# Altium schematic sheet MCU089A_AltRouting_Misc.SchDoc
size 431 x 279 mm; Date: Not shown in title block; ApprovedBy: Not shown in title block; CheckedBy: Not shown in title block; Author: Not shown in title block; CompanyName: Not shown in title block; Engineer: Not shown in title block; Organization: Not shown in title block; Address1: Not shown in title block; Address2: Not shown in title block; Address3: Not shown in title block; Address4: Not shown in title block; DocumentNumber: 3; Revision: Use project parameter SCH_Rev; SheetNumber: 3; SheetTotal: 8; PageSetup: Record=PageOptions|CenterHorizontal=True|CenterVertical=True|PrintScale=1.00|XCorrection=1.00|YCorrection=1.00|PrintKind=0|BorderSize=5000000|LeftOffset=0|BottomOffset=0|Orientation=2|PaperLength=1000|PaperWidth=1000|Scale=100|PaperSource=15|PrintQuality=600|MediaType=1|DitherType=10|PaperKind=Letter|PrintScaleMode=1; CurrentTime: Not shown in title block; CurrentDate: Not shown in title block; Time: Not shown in title block; DocumentFullPathAndName: Not shown in title block; DocumentName: Not shown in title block; ModifiedDate: Not shown in title block; ImagePath: Not shown in title block
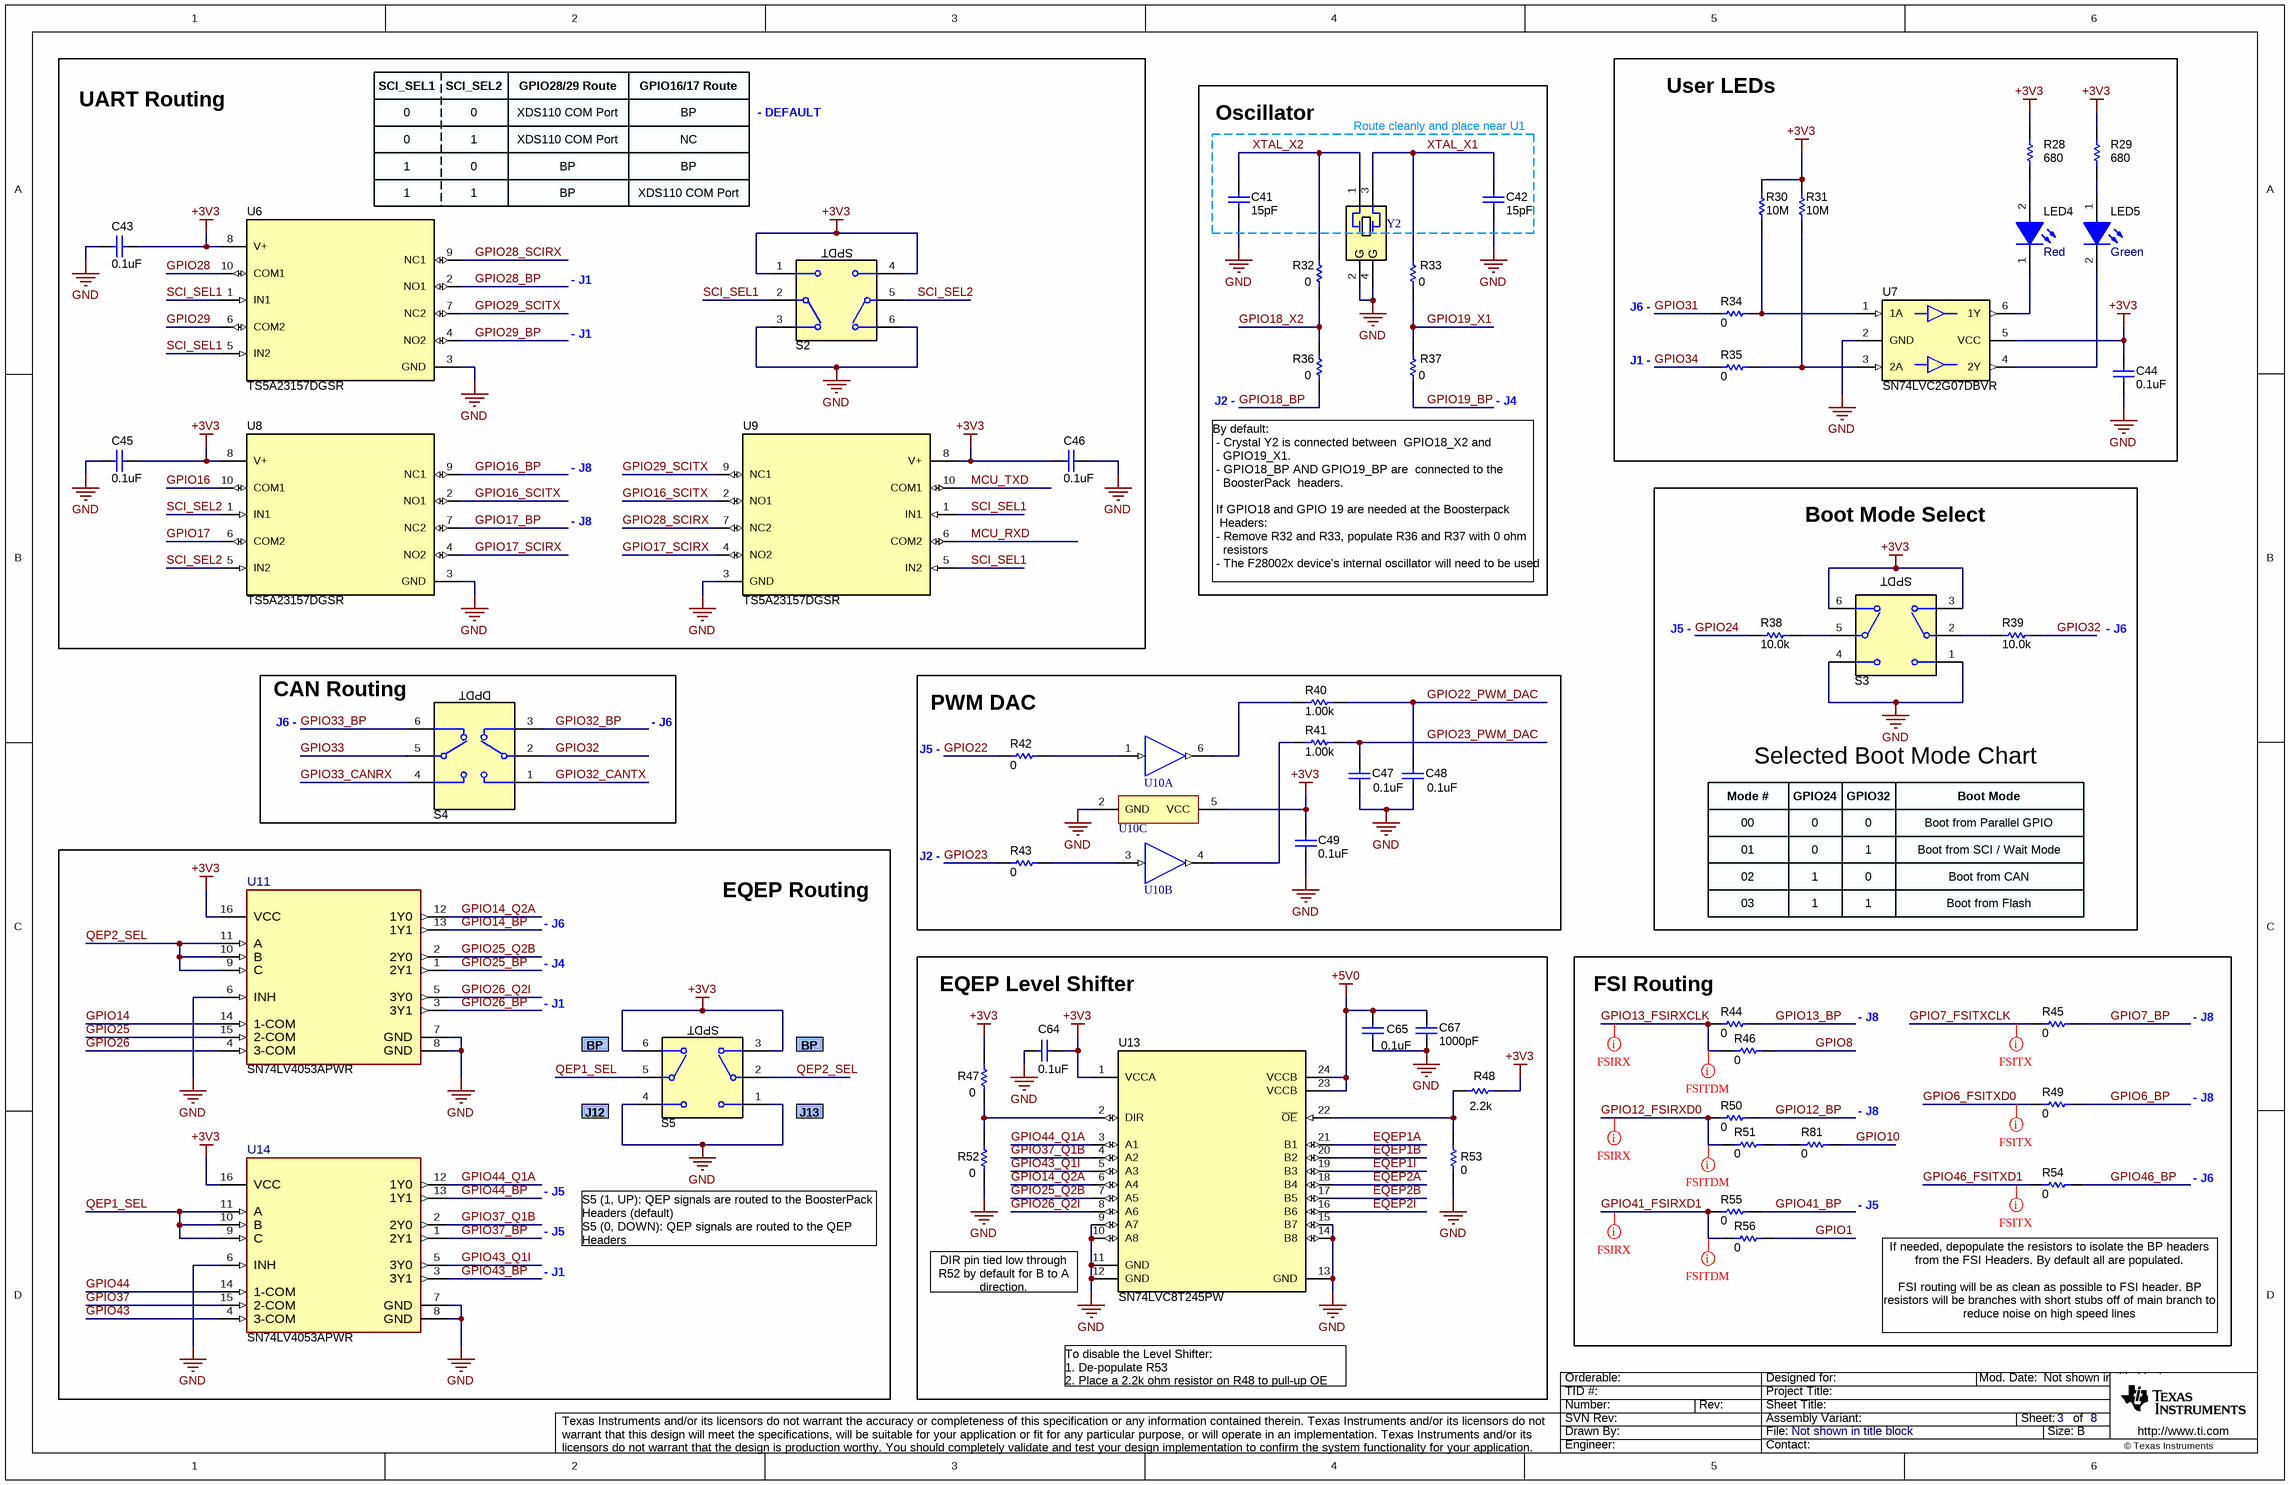
[diagram p0: MCU089A_AltRouting_Misc.SchDoc]

## Parts
C41  ValueDisplayed: 15pF  [0402]  (hidden comment: 885012005056)
C42  ValueDisplayed: 15pF  [0402]  (hidden comment: 885012005056)
C43  ValueDisplayed: 0.1uF  [0402]  (hidden comment: GRM155R71A104KA01D)
C44  ValueDisplayed: 0.1uF  [0402]  (hidden comment: GRM155R71A104KA01D)
C45  ValueDisplayed: 0.1uF  [0402]  (hidden comment: GRM155R71A104KA01D)
C46  ValueDisplayed: 0.1uF  [0402]  (hidden comment: GRM155R71A104KA01D)
C47  ValueDisplayed: 0.1uF  [0402]  (hidden comment: TMK105B7104MV-FR)
C48  ValueDisplayed: 0.1uF  [0402]  (hidden comment: TMK105B7104MV-FR)
C49  ValueDisplayed: 0.1uF  [0402]  (hidden comment: GRM155R71A104KA01D)
C64  ValueDisplayed: 0.1uF  [0402]  (hidden comment: GRM155R71A104KA01D)
C65  ValueDisplayed: 0.1uF  [0402]  (hidden comment: GRM155R71A104KA01D)
C67  ValueDisplayed: 1000pF  [0402]  (hidden comment: 885012205061)
LED4  value Red  [WL-SMCW_RED_0805]  (hidden comment: 150080SS75000)
LED5  value Green  [LED_LTST-C171]  (hidden comment: LTST-C171GKT)
R28  ValueDisplayed: 680  [0402]  (hidden comment: CRCW0402680RJNED)
R29  ValueDisplayed: 680  [0402]  (hidden comment: CRCW0402680RJNED)
R30  ValueDisplayed: 10M  [0402]  (hidden comment: CRCW040210M0JNED)
R31  ValueDisplayed: 10M  [0402]  (hidden comment: CRCW040210M0JNED)
R32  ValueDisplayed: 0  [0603]  (hidden comment: CRCW06030000Z0EA)
R33  ValueDisplayed: 0  [0603]  (hidden comment: CRCW06030000Z0EA)
R34  ValueDisplayed: 0  [0603]  (hidden comment: CRCW06030000Z0EA)
R35  ValueDisplayed: 0  [0603]  (hidden comment: CRCW06030000Z0EA)
R36  ValueDisplayed: 0  [0603]  (hidden comment: CRCW06030000Z0EA)
R37  ValueDisplayed: 0  [0603]  (hidden comment: CRCW06030000Z0EA)
R38  ValueDisplayed: 10.0k  [0603]  (hidden comment: RC0603FR-0710KL)
R39  ValueDisplayed: 10.0k  [0603]  (hidden comment: RC0603FR-0710KL)
R40  ValueDisplayed: 1.00k  [0402]  (hidden comment: CRCW04021K00FKED)
R41  ValueDisplayed: 1.00k  [0402]  (hidden comment: CRCW04021K00FKED)
R42  ValueDisplayed: 0  [0603]  (hidden comment: CRCW06030000Z0EA)
R43  ValueDisplayed: 0  [0603]  (hidden comment: CRCW06030000Z0EA)
R44  ValueDisplayed: 0  [0603]  (hidden comment: CRCW06030000Z0EA)
R45  ValueDisplayed: 0  [0603]  (hidden comment: CRCW06030000Z0EA)
R46  ValueDisplayed: 0  [0603]  (hidden comment: CRCW06030000Z0EA)
R47  ValueDisplayed: 0  [0603]  (hidden comment: CRCW06030000Z0EA)
R48  ValueDisplayed: 2.2k  [0603]  (hidden comment: CRCW06032K20JNEA)
R49  ValueDisplayed: 0  [0603]  (hidden comment: CRCW06030000Z0EA)
R50  ValueDisplayed: 0  [0603]  (hidden comment: CRCW06030000Z0EA)
R51  ValueDisplayed: 0  [0603]  (hidden comment: CRCW06030000Z0EA)
R52  ValueDisplayed: 0  [0603]  (hidden comment: CRCW06030000Z0EA)
R53  ValueDisplayed: 0  [0603]  (hidden comment: CRCW06030000Z0EA)
R54  ValueDisplayed: 0  [0603]  (hidden comment: CRCW06030000Z0EA)
R55  ValueDisplayed: 0  [0603]  (hidden comment: CRCW06030000Z0EA)
R56  ValueDisplayed: 0  [0603]  (hidden comment: CRCW06030000Z0EA)
R81  ValueDisplayed: 0  [0603]  (hidden comment: CRCW06030000Z0EA)
S2  CAS-D20TA  [SW_CAS-D20TA]  (value not drawn)
S3  CAS-D20TA  [SW_CAS-D20TA]  (value not drawn)
S4  CAS-220TA  [SW_CAS-220TA]  (value not drawn)
S5  CAS-D20TA  [SW_CAS-D20TA]  (value not drawn)
U6  TS5A23157DGSR  [DGS0010A_N]
U7  SN74LVC2G07DBVR  [DBV0006A_N]
U8  TS5A23157DGSR  [DGS0010A_N]
U9  TS5A23157DGSR  [DGS0010A_N]
U10  SN74LVC2G34DBVR  [DBV0006A_N]  (value not drawn)  (parts A,B,C of 3)
U11  SN74LV4053APWR  [PW0016A-MFG]
U13  SN74LVC8T245PW  [PW0024A_N]
U14  SN74LV4053APWR  [PW0016A-MFG]
Y2  ECS-200-18-30B-AGN-TR  [ECS_ECX-53B]  (value not drawn)

## Blocks framed on the sheet
UART Routing: C43 C45 C46 S2 U6 U8 U9
Oscillator: C41 C42 R32 R33 R36 R37 Y2
User LEDs: C44 LED4 LED5 R28-R31 R34 R35 U7
Selected Boot Mode Chart: R38 R39 S3
CAN Routing: S4
PWM DAC: C47-C49 R40-R43 U10
EQEP Routing: S5 U11 U14
EQEP Level Shifter: C64 C65 C67 R47 R48 R52 R53 U13
FSI Routing: R44-R46 R49-R51 R54-R56 R81

## Nets
+3V3: C43.1 C44.2 C45.1 C46.2 C49.2 C64.1 R28.2 R29.2 R30.2 R31.2 R47.2 R48.2 S2.1 S2.4 S3.3 S3.6 S5.3 S5.6 U6.8(V+) U7.5(VCC) U8.8(V+) U9.8(V+) U10.5(VCC) U11.16(VCC) U13.1(VCCA) U14.16(VCC)
+5V0: C65.2 C67.1 U13.23(VCCB) U13.24(VCCB)
GND: C41.2 C42.2 C43.2 C44.1 C45.2 C46.1 C47.2 C48.2 C49.1 C64.2 C65.1 C67.2 R52.1 R53.2 S2.3 S2.6 S3.1 S3.4 S5.1 S5.4 U6.3(GND) U7.2(GND) U8.3(GND) U9.3(GND) U10.2(GND) U11.6(INH) U11.7(GND) U11.8(GND) U13.9(A7) U13.10(A8) U13.11(GND) U13.12(GND) U13.13(GND) U13.14(B8) U13.15(B7) U14.6(INH) U14.7(GND) U14.8(GND) Y2.2(GND) Y2.4(GND)
EQEP1A: U13.21(B1)
EQEP1B: U13.20(B2)
EQEP1I: U13.19(B3)
EQEP2A: U13.18(B4)
EQEP2B: U13.17(B5)
EQEP2I: U13.16(B6)
GPIO1: R56.2
GPIO6_BP: R49.2
GPIO6_FSITXD0: R49.1
GPIO7_BP: R45.2
GPIO7_FSITXCLK: R45.1
GPIO8: R46.2
GPIO10: R81.2
GPIO12_BP: R50.2
GPIO12_FSIRXD0: R50.1 R51.1
GPIO13_BP: R44.2
GPIO13_FSIRXCLK: R44.1 R46.1
GPIO14: U11.14(1-COM)
GPIO14_BP: U11.13(1Y1)
GPIO14_Q2A: U11.12(1Y0) U13.6(A4)
GPIO16: U8.10(COM1)
GPIO16_BP: U8.9(NC1)
GPIO16_SCITX: U8.2(NO1) U9.2(NO1)
GPIO17: U8.6(COM2)
GPIO17_BP: U8.7(NC2)
GPIO17_SCIRX: U8.4(NO2) U9.4(NO2)
GPIO18_BP: R36.1
GPIO18_X2: R32.1 R36.2
GPIO19_BP: R37.1
GPIO19_X1: R33.1 R37.2
GPIO22: R42.1
GPIO22_PWM_DAC: C48.1 R40.2
GPIO23: R43.1
GPIO23_PWM_DAC: C47.1 R41.2
GPIO24: R38.1
GPIO25: U11.15(2-COM)
GPIO25_BP: U11.1(2Y1)
GPIO25_Q2B: U11.2(2Y0) U13.7(A5)
GPIO26: U11.4(3-COM)
GPIO26_BP: U11.3(3Y1)
GPIO26_Q2I: U11.5(3Y0) U13.8(A6)
GPIO28: U6.10(COM1)
GPIO28_BP: U6.2(NO1)
GPIO28_SCIRX: U6.9(NC1) U9.7(NC2)
GPIO29: U6.6(COM2)
GPIO29_BP: U6.4(NO2)
GPIO29_SCITX: U6.7(NC2) U9.9(NC1)
GPIO31: R34.1
GPIO32: R39.2 S4.2
GPIO32_BP: S4.3
GPIO32_CANTX: S4.1
GPIO33: S4.5
GPIO33_BP: S4.6
GPIO33_CANRX: S4.4
GPIO34: R35.1
GPIO37: U14.15(2-COM)
GPIO37_BP: U14.1(2Y1)
GPIO37_Q1B: U13.4(A2) U14.2(2Y0)
GPIO41_BP: R55.2
GPIO41_FSIRXD1: R55.1 R56.1
GPIO43: U14.4(3-COM)
GPIO43_BP: U14.3(3Y1)
GPIO43_Q1I: U13.5(A3) U14.5(3Y0)
GPIO44: U14.14(1-COM)
GPIO44_BP: U14.13(1Y1)
GPIO44_Q1A: U13.3(A1) U14.12(1Y0)
GPIO46_BP: R54.2
GPIO46_FSITXD1: R54.1
MCU_RXD: U9.6(COM2)
MCU_TXD: U9.10(COM1)
QEP1_SEL: S5.5(C) U14.9(C) U14.10(B) U14.11(A)
QEP2_SEL: S5.2(C) U11.9(C) U11.10(B) U11.11(A)
SCI_SEL1: S2.2(C) U6.1(IN1) U6.5(IN2) U9.1(IN1) U9.5(IN2)
SCI_SEL2: S2.5(C) U8.1(IN1) U8.5(IN2)
XTAL_X1: C42.1 R33.2 Y2.3
XTAL_X2: C41.1 R32.2 Y2.1
NetLED4_1: LED4.1(K) U7.6(1Y)
NetLED4_2: LED4.2(A) R28.1
NetLED5_1: LED5.1(A) R29.1
NetLED5_2: LED5.2(K) U7.4(2Y)
NetR30_1: R30.1 R34.2 U7.1(1A)
NetR31_1: R31.1 R35.2 U7.3(2A)
NetR38_2: R38.2 S3.5(C)
NetR39_1: R39.1 S3.2(C)
NetR40_1: R40.1 U10.6(1Y)
NetR41_1: R41.1 U10.4(2Y)
NetR42_2: R42.2 U10.1(1A)
NetR43_2: R43.2 U10.3(2A)
NetR47_1: R47.1 R52.2 U13.2(DIR)
NetR48_1: R48.1 R53.1 U13.22(~{OE})
NetR51_2: R51.2 R81.1

## Layout directives
net class FSIRX: GPIO12_FSIRXD0, GPIO13_FSIRXCLK, GPIO41_FSIRXD1
net class FSITX: GPIO6_FSITXD0, GPIO7_FSITXCLK, GPIO46_FSITXD1

## Notes on the sheet
- SCI_SEL1
- SCI_SEL2
- GPIO28/29 Route
- GPIO16/17 Route
- 0
- 1
- XDS110 COM Port
- BP
- NC
- - DEFAULT
- Route cleanly and place near U1
- (near U6) 1
- - J1
- (near S2) SPDT
- J6 -
- J1 -
- J2 -
- - J4
- - J8
- Boot Mode Select
- By default:
  - Crystal Y2 is connected between  GPIO18_X2 and
  GPIO19_X1.
  - GPIO18_BP AND GPIO19_BP are  connected to the
  BoosterPack  headers.
  If GPIO18 and GPIO 19 are needed at the Boosterpack
  Headers:
  - Remove R32 and R33, populate R36 and R37 with 0 ohm
  resistors
  - The F28002x device's internal oscillator will need to be used
- J5 -
- (near S3) SPDT
- - J6
- (near S4) DPDT
- Mode #
- 00
- GPIO24
- GPIO32
- Boot Mode
- Boot from Parallel GPIO
- 01
- 02
- 03
- Boot from SCI / Wait Mode
- Boot from CAN
- Boot from Flash
- (near S5) SPDT
- (near R81) - J8
- J12
- J13
- - J5
- S5 (1, UP): QEP signals are routed to the BoosterPack Headers (default)
  S5 (0, DOWN): QEP signals are routed to the QEP Headers
- (near U13) DIR pin tied low through R52 by default for B to A direction.
- If needed, depopulate the resistors to isolate the BP headers from the FSI Headers. By default all are populated.
  FSI routing will be as clean as possible to FSI header. BP resistors will be branches with short stubs off of main branch to reduce noise on high speed lines
- To disable the Level Shifter:
  1. De-populate R53
  2. Place a 2.2k ohm resistor on R48 to pull-up OE
- Drawn By:
- SVN Rev:
- Number:
- TID #:
- Orderable:
- Rev:
- Sheet Title:
- File:
- Project Title:
- Designed for:
- Assembly Variant:
- Mod. Date:
- Sheet:
- Size:
- of
- B
- http://www.ti.com
- Texas Instruments and/or its licensors do not warrant the accuracy or completeness of this specification or any information contained therein. Texas Instruments and/or its licensors do not warrant that this design will meet the specifications, will be suitable for your application or fit for any particular purpose, or will operate in an implementation. Texas Instruments and/or its licensors do not warrant that the design is production worthy. You should completely validate and test your design implementation to confirm the system functionality for your application.
- Engineer:
- Contact:
- © Texas Instruments
- (in symbol CMP-0080365-2) G

## Library data of the parts
C41 C42 = CMP-0006216-2: CAP, CERM, 15 pF, 50 V, +/- 5%, C0G/NP0, 0402; Manufacturer: Wurth Elektronik; Polarized: N; Value: 15pF; U/M: EA; Value1: Unknown; VDC_V: 50V; TaMin_C: -55°C; TaMax_C: 125°C; SizeArea_mm2: 0.5; SizeAreaWB_mm2: 3; SizeX_mm: 1; SizeZ_mm: 0.6; AEC Category: Q200; CompType: Capacitor; PartNumber: 885012005056; PackageReference: 0402; RoHS: Y; Cap_F: 15pF; Tolerance_%: 5%; Value2: 50V; MountType: SMT; Technology: Ceramic; TempCo: C0G/NP0; Cap_Case: 0402; SizeY_mm: 0.5; Published: 2008-06-19; Publisher: Texas Instruments; LatestRevisionDate: 2017-03-09; ComponentLink1Description: Datasheet link; ComponentLink1URL: http://katalog.we-online.de/pbs/datasheet/885012005056.pdf; Supplier 1: Mouser; Supplier Part Number 1: 710-885012005056; AEC Qualified: N; AEC Grade: N/A
C43-C46 C49 C64 C65 = CMP-0006629-2: CAP, CERM, 0.1 uF, 10 V, +/- 10%, X7R, 0402; Manufacturer: MuRata; Polarized: N; Value: 0.1uF; U/M: EA; Cap_F: 100nF; Value1: Unknown; VDC_V: 10V; TaMin_C: -55°C; TaMax_C: 125°C; SizeArea_mm2: 0.5; SizeAreaWB_mm2: 3; SizeX_mm: 1; SizeZ_mm: 0.6; AEC Category: Q200; CompType: Capacitor; PartNumber: GRM155R71A104KA01D; PackageReference: 0402; RoHS: Y; Tolerance_%: 10%; Value2: 10V; MountType: SMT; Technology: Ceramic; TempCo: X7R; Cap_Case: 0402; SizeY_mm: 0.5; Published: 2008-06-19; Publisher: Texas Instruments; LatestRevisionDate: 2017-03-09; ComponentLink1Description: Datasheet link; ComponentLink1URL: http://search.murata.co.jp/Ceramy/PnsearchViewAction.do?HnOFG=ON&HnNFG=ON&SEL_CNT=50&sLang=en&sKey=GRM155R71A104KA01D&x=9&y=9&search=startwith; Supplier 1: Digi-Key; Supplier Part Number 1: GRM155R71A104KA01D-ND; Supplier 2: Newark; Supplier Part Number 2: 14T3278; Supplier 3: Mouser; Supplier Part Number 3: 81-GRM155R71A104KA1D; AEC Qualified: ?
C47 C48 = CMP-0006720-2: CAP, CERM, 0.1 uF, 25 V, +/- 20%, X7R, 0402; Manufacturer: Taiyo Yuden; TaMin_C: -55°C; Polarized: N; SizeAreaWB_mm2: 3; Value1: Unknown; U/M: EA; Value: 0.1uF; TaMax_C: 125°C; SizeZ_mm: 0.6; SizeX_mm: 1; SizeY_mm: 0.5; Value2: 25V; Cap_F: 100nF; AEC Category: Q200; Publisher: Texas Instruments; TempCo: X7R; Published: 2008-06-19; RoHS: Y; MountType: SMT; PackageReference: 0402; Tolerance_%: 20%; Cap_Case: 0402; SizeArea_mm2: 0.5; CompType: Capacitor; LatestRevisionDate: 2017-03-09; PartNumber: TMK105B7104MV-FR; AEC Qualified: N; VDC_V: 25V; ComponentLink1Description: Datasheet link; AEC Grade: N/A; Technology: Ceramic; ComponentLink1URL: http://www.yuden.co.jp/productdata/catalog/en/mlcc_all_e.pdf
C67 = CMP-0006231-2: CAP, CERM, 1000 pF, 50 V, +/- 10%, X7R, 0402; Manufacturer: Wurth Elektronik; Polarized: N; Value: 1000pF; U/M: EA; Cap_F: 1nF; Value1: Unknown; VDC_V: 50V; TaMin_C: -55°C; TaMax_C: 125°C; SizeArea_mm2: 0.5; SizeAreaWB_mm2: 3; SizeX_mm: 1; SizeZ_mm: 0.6; AEC Category: Q200; CompType: Capacitor; PartNumber: 885012205061; PackageReference: 0402; RoHS: Y; Tolerance_%: 10%; Value2: 50V; MountType: SMT; Technology: Ceramic; TempCo: X7R; Cap_Case: 0402; SizeY_mm: 0.5; Published: 2008-06-19; Publisher: Texas Instruments; LatestRevisionDate: 2017-03-09; ComponentLink1Description: Datasheet link; ComponentLink1URL: http://katalog.we-online.de/pbs/datasheet/885012205061.pdf; Supplier 1: Digi-Key; Supplier Part Number 1: 732-7556-1-ND; Supplier 2: Mouser; Supplier Part Number 2: 710-885012205061; AEC Qualified: N; AEC Grade: N/A
LED4 = CMP-0002951-3: LED, Red, SMD; Manufacturer: Wurth Elektronik; Type: AlInGaP; Vf_V: 1.9V; Io_A: 30mA; Vr_V: 5V; Ir_A: 25µA; Tjmax_C: 85°C; Power_TotalModule: 72mW; Value1: 0.072W; Angle: 140; CompType: LED; PartNumber: 150080SS75000; MountType: SMT; RoHS: Y; PackageReference: LED_0805; Value2: 1.9V; Color: Red; ComponentLink1URL: http://katalog.we-online.de/led/datasheet/150080SS75000.pdf; ComponentLink1Description: Datasheet link
LED5 = CMP-0002830-3: LED, Green, SMD; Manufacturer: Lite-On; Type: AlInGaP; Vf_V: 2.1V; Io_A: 20A; Value1: W; SizeAreaWB_mm2: 6.75; SizeArea_mm2: 2.5; SizeX_mm: 2; SizeY_mm: 1.25; SizeZ_mm: 1.2; CompType: LED; PartNumber: LTST-C171GKT; MountType: SMT; RoHS: Y; PackageReference: 0805 LED; Value2: 2.1V; Color: green; ComponentLink1URL: https://sps06.itg.ti.com/sites/KMS/crossdivteams/altium/docs/ComponentDatasheets/LTST-C171GKT.pdf; ComponentLink1Description: Datasheet link
R28 R29 = CMP-0026962-3: RES, 680, 5%, 0.063 W, AEC-Q200 Grade 0, 0402; Manufacturer: Vishay-Dale; Power_W: 63mW; TempCo: 200 ppm/C; Value_Code: 680R; Value: 680; EIA_Code: E24; SizeX_mm: 1; SizeY_mm: 0.5; SizeZ_mm: 0.6; Value2: 0.063W; CompType: Resistor; AEC Qualified: Y; VDC_V: 50V; AEC Category: Q200; AEC Grade: 0; Supplier Part Number 2: 59M6744; Supplier 2: Newark; Supplier Part Number 3: 71-CRCW0402J-680-E3; Supplier 3: Mouser; RoHS: E; Value1: 5%; MountType: SMT; Supplier 1: Digi-Key; PackageReference: 0402; Tolerance_%: 5%; Res_ohm: 680; SizeArea_mm2: 0.5; PartNumber: CRCW0402680RJNED; ComponentLink1Description: Datasheet link; Supplier Part Number 1: 541-680JCT-ND; Technology: Thick Film; ComponentLink1URL: http://www.vishay.com/docs/20035/dcrcwe3.pdf
R30 R31 = CMP-0026826-2: RES, 10 M, 5%, 0.063 W, AEC-Q200 Grade 0, 0402; Manufacturer: Vishay-Dale; Value: 10Meg; Value_Code: 10M0; Power_W: 63mW; Value2: 0.063W; VDC_V: 50V; TempCo: 200 ppm/C; SizeArea_mm2: 0.5; SizeX_mm: 1; SizeZ_mm: 0.6; EIA_Code: E24; AEC Category: Q200; AEC Qualified: Y; AEC Grade: 0; CompType: Resistor; PartNumber: CRCW040210M0JNED; PackageReference: 0402; RoHS: E; Res_ohm: 10M; Tolerance_%: 5%; Value1: 5%; MountType: SMT; Technology: Thick Film; SizeY_mm: 0.5; ComponentLink1Description: Datasheet link; ComponentLink1URL: http://www.vishay.com/docs/20035/dcrcwe3.pdf; Supplier 1: Digi-Key; Supplier Part Number 1: 541-10MJCT-ND; Supplier 2: Newark; Supplier Part Number 2: 59M6697; Supplier 3: Mouser; Supplier Part Number 3: 71-CRCW0402J-10M-E3
R32-R37 R42-R47 R49-R56 R81 = CMP-0025697-4: RES, 0, 5%, 0.1 W, AEC-Q200 Grade 0, 0603; Manufacturer: Vishay-Dale; Value: 0; Value_Code: 0000; Power_W: 100mW; Value2: 0.1W; VDC_V: 75V; TempCo: 200 ppm/C; SizeArea_mm2: 1.28; SizeX_mm: 1.6; SizeY_mm: 0.8; SizeZ_mm: 1; EIA_Code: E24; AEC Category: Q200; AEC Qualified: Y; CompType: Resistor; PartNumber: CRCW06030000Z0EA; PackageReference: 0603; RoHS: E; Res_ohm: 0; Tolerance_%: 5%; Value1: 5%; MountType: SMT; Technology: Thick Film; ComponentLink1Description: Datasheet link; ComponentLink1URL: http://www.vishay.com/docs/20035/dcrcwe3.pdf; Supplier 1: Digi-Key; Supplier Part Number 1: 541-0.0GCT-ND; Supplier 2: Newark; Supplier Part Number 2: 52K8014; Supplier 3: Mouser; Supplier Part Number 3: 71-CRCW0603-0-E3; AEC Grade: 0
R38 R39 = CMP-0022746-5: RES, 10.0 k, 1%, 0.1 W, 0603; Manufacturer: Yageo; Power_W: 100mW; TempCo: 100 ppm/C; Value_Code: 10k0; Value: 10.0k; EIA_Code: E96; Res_ohm: 10k; SizeX_mm: 1.6; SizeY_mm: 0.8; SizeZ_mm: 1; Value2: 0.1W; SizeArea_mm2: 1.28; AEC Qualified: N; VDC_V: 75V; AEC Category: Q200; SizeAreaWB_mm2: 4.68; Supplier Part Number 2: 603-RC0603FR-0710KL; Supplier 2: Mouser; Supplier Part Number 3: 9238603; Supplier 3: Farnell; RoHS: Y; Value1: 1%; MountType: SMT; Supplier 1: Digi-Key; PackageReference: 0603; Tolerance_%: 1%; CompType: Resistor; PartNumber: RC0603FR-0710KL; ComponentLink1Description: Datasheet link; Supplier Part Number 1: 311-10.0KHRCT-ND; Technology: Thick Film; ComponentLink1URL: http://www.yageo.com/pdf/Pu-RC0603_51_PbFree_L_2.pdf; AEC Grade: N/A
R40 R41 = CMP-0026071-3: RES, 1.00 k, 1%, 0.063 W, AEC-Q200 Grade 0, 0402; Manufacturer: Vishay-Dale; Power_W: 63mW; TempCo: 100 ppm/C; Value_Code: 1k00; Value: 1.00k; EIA_Code: E96; Res_ohm: 1k; SizeX_mm: 1; SizeY_mm: 0.5; SizeZ_mm: 0.6; Value2: 0.063W; AEC Qualified: Y; VDC_V: 50V; AEC Category: Q200; AEC Grade: 0; Supplier Part Number 2: 52K6545; Supplier 2: Newark; Supplier Part Number 3: 71-CRCW0402-1.0K-E3; Supplier 3: Mouser; RoHS: E; Value1: 1%; MountType: SMT; Supplier 1: Digi-Key; PackageReference: 0402; Tolerance_%: 1%; SizeArea_mm2: 0.5; CompType: Resistor; PartNumber: CRCW04021K00FKED; ComponentLink1Description: Datasheet link; Supplier Part Number 1: 541-1.00KLCT-ND; Technology: Thick Film; ComponentLink1URL: http://www.vishay.com/docs/20035/dcrcwe3.pdf
R48 = CMP-0025769-4: RES, 2.2 k, 5%, 0.1 W, AEC-Q200 Grade 0, 0603; Manufacturer: Vishay-Dale; Value: 2.2k; Value_Code: 2k20; Power_W: 100mW; Value2: 0.1W; VDC_V: 75V; TempCo: 200 ppm/C; SizeArea_mm2: 1.28; SizeX_mm: 1.6; SizeY_mm: 0.8; SizeZ_mm: 1; EIA_Code: E24; AEC Category: Q200; AEC Qualified: Y; AEC Grade: 0; CompType: Resistor; PartNumber: CRCW06032K20JNEA; PackageReference: 0603; RoHS: E; Res_ohm: 2.2k; Tolerance_%: 5%; Value1: 5%; MountType: SMT; Technology: Thick Film; ComponentLink1Description: Datasheet link; ComponentLink1URL: http://www.vishay.com/docs/20035/dcrcwe3.pdf; Supplier 1: Digi-Key; Supplier Part Number 1: 541-2.2KGCT-ND; Supplier 2: Newark; Supplier Part Number 2: 59M6776; Supplier 3: Farnell; Supplier Part Number 3: 1652868
S2 S5 = CMP-0002233-1: Switch, Dual SPDT,  2 Pos, 0.1A, 6VDC, SMD; Manufacturer: Copal Electronics; VDC_V: 6V; SwitchFunction: On-On; PositionCount: 2; CurrentRating_mA: 100A; PartNumber: CAS-D20TA; MountType: SMT; ComponentLink1Description: Datasheet Link; ComponentLink1URL: http://www.nidec-copal-electronics.com/e/catalog/switch/cas.pdf; RoHS: Y; Circuit: SPDT; Orientation: Top Actuated; CompType: Switch; PackageReference: 5.4x3.9mm; Publisher: Texas Instruments; LatestRevisionDate: 2017-03-09; Supplier 1: Digi-Key; Supplier Part Number 1: CASD20JCT-ND
S3 = CMP-0002233-1: Switch, Dual SPDT,  2 Pos, 0.1A, 6VDC, SMD; Manufacturer: Copal Electronics; CurrentRating_mA: 100A; SwitchFunction: On-On; VDC_V: 6V; PositionCount: 2; ComponentLink1Description: Datasheet Link; LatestRevisionDate: 2017-03-09; PackageReference: 5.4x3.9mm; Publisher: Texas Instruments; Supplier 1: Digi-Key; ComponentLink1URL: http://www.nidec-copal-electronics.com/e/catalog/switch/cas.pdf; Supplier Part Number 1: CASD20JCT-ND; MountType: SMT; Circuit: SPDT; Orientation: Top Actuated; PartNumber: CAS-D20TA; CompType: Switch; RoHS: Y
S4 = CMP-0002123-2: SLIDE SWITCH DPDT  .1A, SMT; Manufacturer: Copal Electronics; VDC_V: 6V; SwitchFunction: On-On; PositionCount: 2; CurrentRating_mA: 100A; PartNumber: CAS-220TA; MountType: SMT; ComponentLink1Description: Datasheet URL; ComponentLink1URL: http://copal-electronics.info/en/0008e/02462.pdf; RoHS: Y; Circuit: DPDT; Orientation: Horizontal; CompType: Switch; PackageReference: SWITCH, 5.4x2.5x3.9mm; Publisher: Texas Instruments; LatestRevisionDate: 2017-03-09; Supplier 1: Digi-Key; Supplier Part Number 1: CAS220JCT-ND
U6 U8 U9 = CMP-0067418-1: DUAL 10-Ohm SPDT ANALOG SWITCH, DGS0010A (VSSOP-10); Alternate PartNumber: TS5A23157DGST; Alternate Manufacturer: Texas Instruments; Green_Lifecycle: Active; SizeAreaWB_mm2: 23.6; Green_REACh: Passed; U/M: EA; SizeZ_mm: 1.1; SizeX_mm: 4.9; SizeY_mm: 3.0; SizeArea_mm2: 14.7; CompType: IC; ComponentLink1URL: http://www.ti.com/lit/ds/symlink/ts5a23157.pdf; Publisher: Texas Instruments; PackageDescription: VSSOP-10; RoHS: Y; Footprint Path 6: C:\AltiumLibraries\Footprints\TI\.PcbLib; MountType: SMT; Green_EU RoHS-2: Passed; Manufacturer: Texas Instruments; Green_EU RoHS: Passed; PackageReference: DGS0010A; LatestRevisionDate: 2017-06-09; PartNumber: TS5A23157DGSR; ComponentLink1Description: Datasheet Link
U7 = CMP-0051789-2: Dual Buffer/Driver with Open-Drain Output, DBV0006A, LARGE T&R; Manufacturer: Texas Instruments; VCC(Min)(V): 1.65; VCC(Max)(V): 5.5; Output Type: CMOS; ICC @ Nom Voltage(Max)(mA): 0.01; Input Type: CMOS/TTL; Bits(#): 2; F @ Nom Voltage(Max)(Mhz): 150; Rating: Catalog; Technology Family: LVC; Voltage(Nom)(V): 1.8,2.5,3.3,5; Schmitt Trigger: No; Output Drive (IOL/IOH)(Max)(mA): 32/-32; tpd @ Nom Voltage(Max)(ns): 8.6,4.4,3.7,2.9; Logic: True; Sub-Family: Inverting Buffer/Driver; AEC Category: Q200; AEC Qualified: N; CompType: IC; Green_Lifecycle: Active; Green_REACh: Passed; SizeArea_mm2: 8.12; SizeAreaWB_mm2: 14.82; SizeX_mm: 2.8; SizeY_mm: 2.9; SizeZ_mm: 1.45; DatasheetVersion: SCES308K; PackageReference: DBV0006A; Generic Part Number: SN74LVC2G07; Operating Temperature Range(C): -40 to 125; 3-State Output: No; ComponentLink1Description: Datasheet Link; ComponentLink1URL: http://www.ti.com/lit/ds/symlink/sn74lvc2g07.pdf; ComponentLink2Description: Product Folder; ComponentLink2URL: http://www.ti.com/product/sn74lvc2g07; ComponentLink3Description: Online Datasheet; ComponentLink3URL: http://www.ti.com/product/sn74lvc2g07/datasheet; Green_EU RoHS-2: Passed; Green_EU RoHS: Passed; MountType: SMT; PackageDescription: SOT-23-6; PartNumber: SN74LVC2G07DBVR; RoHS: Y
U10 = CMP-0051910-1: Dual Buffer Gate, DBV0006A, LARGE T&R; Manufacturer: Texas Instruments; Logic: True; F @ Nom Voltage(Max)(Mhz): 150; Output Type: CMOS; Output Drive (IOL/IOH)(Max)(mA): 32/-32; Voltage(Nom)(V): 1.8,2.5,3.3,5; 3-State Output: No; VCC(Max)(V): 5.5; ICC @ Nom Voltage(Max)(mA): 0.01; Technology Family: LVC; Input Type: CMOS/TTL; VCC(Min)(V): 1.65; Bits(#): 2; tpd @ Nom Voltage(Max)(ns): 8.6,4.4,4.1,3.2; Rating: Catalog; Sub-Family: Non-Inverting Buffer/Driver; Generic Part Number: SN74LVC2G34; Operating Temperature Range(C): -40 to 125,-40 to 85; DatasheetVersion: SCES359I; Schmitt Trigger: No; PackageReference: DBV0006A
U11 U14 = CMP-0089841-1: 3 Circuit IC Switch 2:1 75Ohm 16-TSSOP; Manufacturer: Texas Instruments; TaMax_C: +85°C; Max Supply Voltage: 5.5V; PositionCount: 3; AEC Qualified: No; SizeZ_mm: 1.2mm; Standoff Height: 0.05mm; On State Resistance: 100-225Ω; Min Supply Voltage: 2V; -3Db Bandwith: 50MHz; Nominal Supply Current: 20uA; TaMin_C: -40°C; Lead Free: Yes; Operating Temperature Range: -40°C to +85°C; Mux Demux Ratio: 2:1; ComponentLink1Description: Datasheet; Part Number: SN74LV4053APWR; Digikey Description: IC MUX/DEMUX TRIPLE 2X1 16TSSOP; ComponentLink1URL: https://upverter.com/datasheet/3a9d815208c4051a64f1f6fd539a8c5a24990e71.pdf; PartNumber: SN74LV4053APWR; Mouser Description: Multiplexer Switch ICs Triple 2-Ch Analog; Mouser Part Number: 595-SN74LV4053APWR; RoHS: TRUE; PackageReference: TSSOP16; helpURL: https://upverter.com/upn/revision/43c5e7c12a31b2aa/; datasheet: https://upverter.com/datasheet/3a9d815208c4051a64f1f6fd539a8c5a24990e71.pdf; Digikey Part Number: 296-3833-1-ND; Datasheet Path: datasheets/IC-SN74LV4053APWR.pdf
U13 = CMP-0066458-2: 8-Bit Dual-Supply Bus Transceiver with Configurable Voltage-Level Shifting and Three-State Outputs, PW0024A (TSSOP-24); Alternate Manufacturer: Texas Instruments; SizeAreaWB_mm2: 82.32; SizeZ_mm: 1.2; SizeX_mm: 6.4; SizeY_mm: 7.8; SizeArea_mm2: 49.92; CompType: IC; AEC Category: Q200; AEC Qualified: N; Rating: Catalog; ComponentLink1URL: http://www.ti.com/lit/ds/symlink/sn74lvc8t245.pdf; PackageDescription: TSSOP-24; RoHS: Y; MountType: SMT; Manufacturer: Texas Instruments; PackageReference: PW0024A; PartNumber: SN74LVC8T245PW; ComponentLink1Description: Datasheet Link; ComponentLink2Description: Product Folder; ComponentLink2URL: http://www.ti.com/product/sn74lvc8t245; ComponentLink3Description: Online Datasheet; ComponentLink3URL: http://www.ti.com/product/sn74lvc8t245/datasheet; Operating Temperature Range: -40 to 85 C
Y2 = CMP-0080365-2: Crystal, 20 MHz, 25 ppm, 18 pF, SMD; Manufacturer: ECS Inc.; Frequency Stability: 30 ppm; AEC Qualified: N; Frequency Tolerance: 25 ppm; AEC Category: Q200; TaMax_C: 85°C; Frequency_Fixed: 20MHz; TaMin_C: -40°C; Load Capacitance: 18 pF; ComponentLink1Description: Datasheet Link; RoHS: Y; Supplier 1: Digi-Key; PackageReference: 5x3.2mm; PartNumber: ECS-200-18-30B-AGN-TR; Supplier Part Number 2: 520-200-18-30B-AGNT; Supplier 2: Mouser; AEC Grade: N/A; ComponentLink1URL: http://www.ecsxtal.com/store/pdf/ecx_53b.pdf; CompType: Crystal; Supplier Part Number 1: XC2693CT-ND; MountType: SMT